# EasyEDA Pro project ProProject_2024电赛备赛清单_Wang01_2024-08-05.epro, schematic Schematic5
Create Date: 2024-07-20; Page Name: P1; Project Name: 2024电赛备赛清单_Wang01; Schematic Name: Schematic5; Update Date: 2024-07-20; Company: 嘉立创EDA; Page Size: A4; Version: V1.0
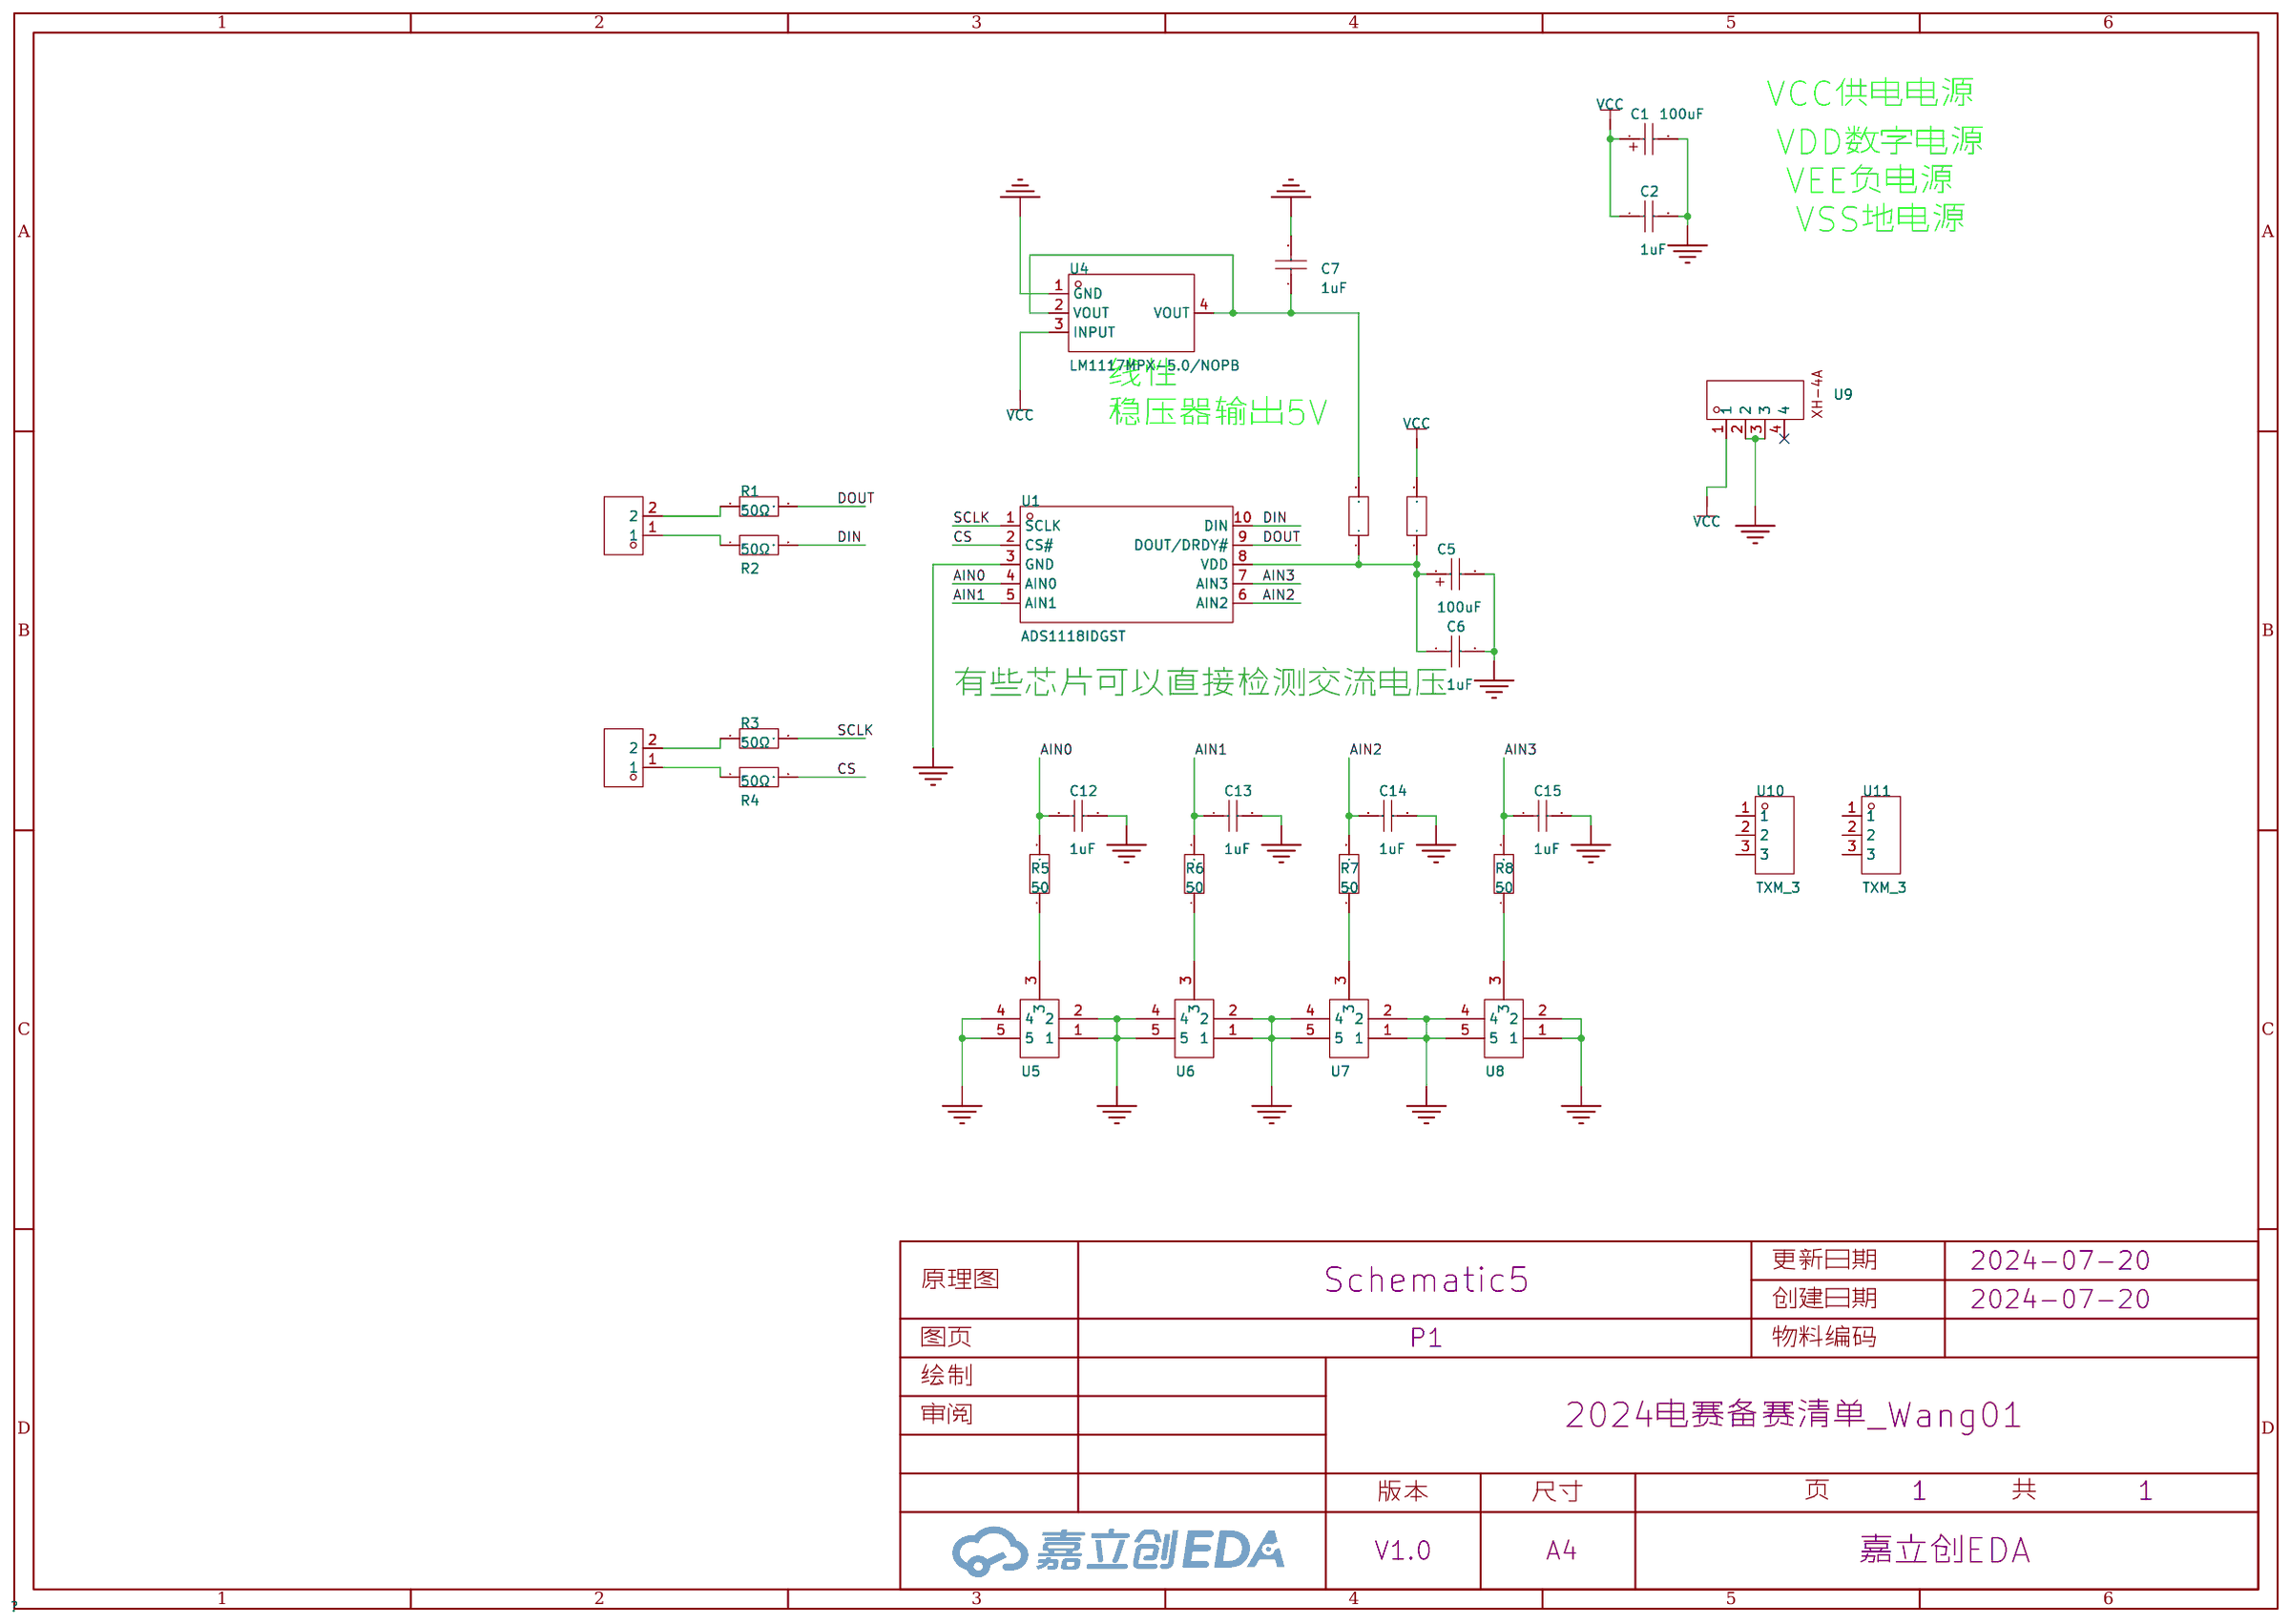
[diagram p9: schematic sheet]

## Parts
C1  100uF  [CASE-B_3528]
C2  1uF  [C0805]
C3  1MΩ  [R0805]
C4  Ω  [R0805]
C5  100uF  [CASE-B_3528]
C6  1uF  [C0805]
C7  1uF  [C0805]
C12  1uF  [C0805]
C13  1uF  [C0805]
C14  1uF  [C0805]
C15  1uF  [C0805]
R1  50Ω  [R0805]
R2  50Ω  [R0805]
R3  50Ω  [R0805]
R4  50Ω  [R0805]
R5  50  [R0805]
R6  50  [R0805]
R7  50  [R0805]
R8  50  [R0805]
U1  ADS1118IDGST  [VSSOP-10_L3.0-W3.0-P0.50-LS4.9-BL]
U2  HDR1X2  [HDR-TH_2P-P2.54-V-M-1]
U3  HDR1X2  [HDR-TH_2P-P2.54-V-M-1]
U4  LM1117MPX-5.0/NOPB  [SOT-223-4_L6.5-W3.5-P2.30-LS7.0-BR]
U5  -  [5孔SMA/排针通用]
U6  -  [5孔SMA/排针通用]
U7  -  [5孔SMA/排针通用]
U8  -  [5孔SMA/排针通用]
U9  -  [XH-4A]
U10  TXM_3  [HDR-TH_3P-P2.54-V-M-A]
U11  TXM_3  [HDR-TH_3P-P2.54-V-M-A]

## Library data of the parts
C1 C5 = TAJB107K006RNJ: 容值:100uF;精度:±10%;额定电压:6.3V;等效串联电阻:1.7Ω@100kHz;工作温度:-55℃~+125℃;; LCSC Part Name: 100uF ±10% 6.3V; Supplier Part: C16133; Manufacturer: Kyocera AVX; JLCPCB Part Class: Basic Part; Datasheet: https://atta.szlcsc.com/upload/public/pdf/source/20160107/1457707750344.pdf; Supplier: LCSC; Tolerance: ±10%; Rated Voltage: 6.3V; Equivalent Series Resistance(ESR): 1.7Ω@100kHz; Operating Temperature: -55℃~+125℃
C2 C6 C7 C12-C15 = CL21B105KBFNNNE: 容值:1uF;精度:±10%;额定电压:50V;材质(温度系数):X7R;; LCSC Part Name: 1uF ±10% 50V; Supplier Part: C28323; Manufacturer: SAMSUNG(三星); Supplier Footprint: 0805; JLCPCB Part Class: Basic Part; Datasheet: https://atta.szlcsc.com/upload/public/pdf/source/20160103/1457707718219.pdf; Supplier: LCSC; Tolerance: ±10%; Voltage Rated: 50V; Temperature Coefficient: X7R
C3 C4 R1-R8 = HVC0805T1004JET: 电阻类型:厚膜电阻;阻值:1MΩ;精度:±5%;功率:125mW;; LCSC Part Name: 厚膜电阻 1MΩ ±5% 125mW; Supplier Part: C4322748; Manufacturer: Ohmite; Supplier Footprint: 0805; Supplier: LCSC; Type: 厚膜电阻; Tolerance: ±5%; Power(Watts): 125mW; Temperature Coefficient: ±100ppm/℃; Operating Temperature Range: -55℃~+155℃
U1 = ADS1118IDGST: 具有 PGA、振荡器、电压基准、温度传感器和 SPI 的 16 位、860SPS、4 通道 Δ-Σ ADC; Supplier Part: C701612; Manufacturer: TI(德州仪器); Supplier Footprint: VSSOP-10-0.5mm; JLCPCB Part Class: Extended Part; Supplier: LCSC
U2 U3 = HDR1X2: Supplier Part: C9900014921; Supplier Footprint: 排针; JLCPCB Part Class: Extended Part; Supplier: LCSC
U4 = LM1117MPX-5.0/NOPB_C730069: 输出类型:-;; Supplier Part: C730069; Manufacturer: TI(德州仪器); Supplier Footprint: SOT-223-4; JLCPCB Part Class: Extended Part; Supplier: LCSC
U5-U8 = 5孔/SMA、排针通用
U9 = XH-4A
U10 U11 = TXM_3: Supplier Part: C9900014923; Supplier Footprint: 排针; JLCPCB Part Class: Extended Part; Datasheet: https://atta.szlcsc.comnull; Supplier: LCSC

## Nets
GND: C1.2 C2.2 C5.2 C6.2 C7.2 C12.2 C13.2 C14.2 C15.2 U1.3(GND) U4.1(GND) U5.1 U5.2 U5.4 U5.5 U6.1 U6.2 U6.4 U6.5 U7.1 U7.2 U7.4 U7.5 U8.1 U8.2 U8.4 U8.5 U9.2 U9.3
VCC: C1.1 C2.1 C3.2 U4.3(INPUT) U9.1
AIN0: C12.1 R5.2 U1.4(AIN0)
AIN1: C13.1 R6.2 U1.5(AIN1)
AIN2: C14.1 R7.2 U1.6(AIN2)
AIN3: C15.1 R8.2 U1.7(AIN3)
CS: R4.2 U1.2(CS#)
DIN: R2.2 U1.10(DIN)
DOUT: R1.2 U1.9(DOUT/DRDY#)
SCLK: R3.2 U1.1(SCLK)
Net-(C3-1): C3.1 C4.1 C5.1 C6.1 U1.8(VDD)
Net-(C4-2): C4.2 C7.1 U4.2(VOUT) U4.4(VOUT)
Net-(R1-1): R1.1 U2.2
Net-(R2-1): R2.1 U2.1
Net-(R3-1): R3.1 U3.2
Net-(R4-1): R4.1 U3.1
Net-(R5-1): R5.1 U5.3
Net-(R6-1): R6.1 U6.3
Net-(R7-1): R7.1 U7.3
Net-(R8-1): R8.1 U8.3

Not connected (* = marked no-connect by the designer): U9 4*; U10 1 2 3; U11 1 2 3

## Notes on the sheet
- VCC供电电源
- VDD数字电源
- VEE负电源
- VSS地电源
- 线性
  稳压器输出5V
- 有些芯片可以直接检测交流电压
